# Altium schematic sheet nRF24L01.SchDoc
size A4
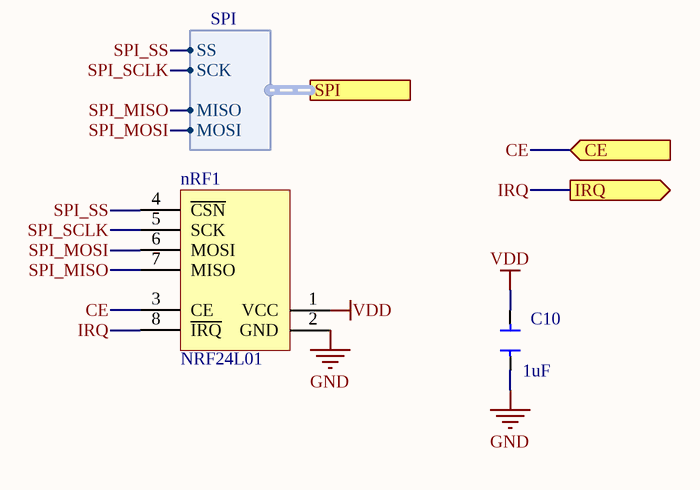
[diagram p0: nRF24L01.SchDoc]

## Parts
C10  value 1uF  [Cap_0603]  (hidden comment: Cap)
nRF1  NRF24L01  [NRF24L01P+PA+LNA+IPX]

## Ports
CE (in), IRQ (out), SPI (harness SPI)

## Harnesses
SPI: SS, SCK, MISO, MOSI

## Nets
GND: C10.2 nRF1.2(GND)
VDD: C10.1 nRF1.1(VCC)
CE: nRF1.3(CE) ; port CE
IRQ: nRF1.8(~{IRQ}) ; port IRQ
SPI_MISO: nRF1.7(MISO) ; port SPI.MISO
SPI_MOSI: nRF1.6(MOSI) ; port SPI.MOSI
SPI_SCLK: nRF1.5(SCK) ; port SPI.SCK
SPI_SS: nRF1.4(~{CSN}) ; port SPI.SS

## Library data of the parts
nRF1 = NRF24L01_module: pin to pad: 2>8 3>2 4>3 5>4 6>5 7>6 8>7